# EAGLE design HG8M_breakout (EAGLE 7.1.0)
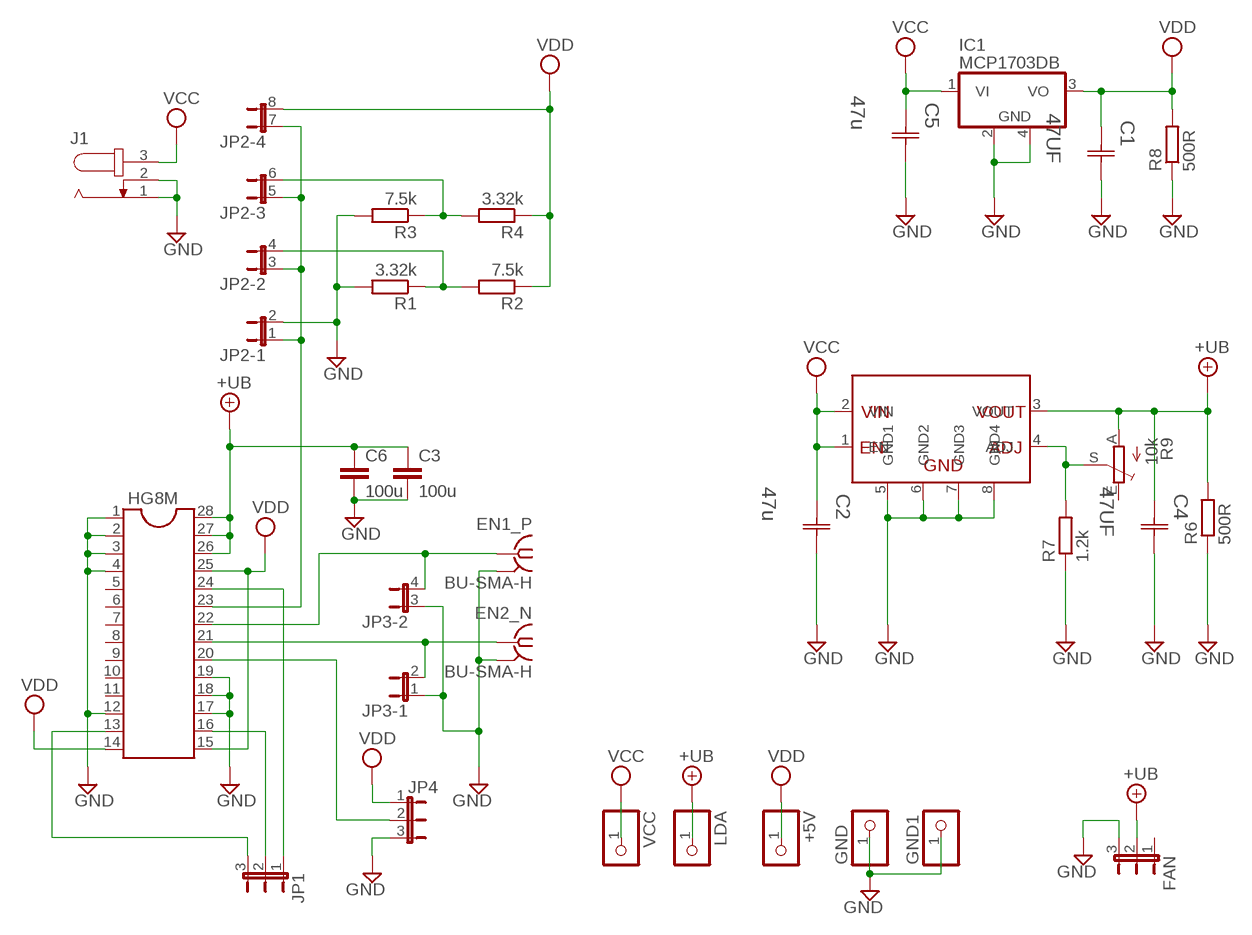
[diagram p0: schematic, sheet 1]

## Parts
+5V  PINHD-1X1  [1X01]
C1  47UF  TPSC476M010R0350  [CAPCP6032X280N]
C2  47u  12101A471JAT2A  [CAPC3225X94N]
C3  100u  C-EUC1210  [C1210]
C4  47UF  TPSC476M010R0350  [CAPCP6032X280N]
C5  47u  12101A471JAT2A  [CAPC3225X94N]
C6  100u  C-EUC1210  [C1210]
EN1_P  BU-SMA-H  [BU-SMA-H]
EN2_N  BU-SMA-H  [BU-SMA-H]
FAN  JP2E  [JP2]
GND  PINHD-1X1  [1X01]
GND1  PINHD-1X1  [1X01]
HG8M  DIL28  [DIL28-6]
IC1  MCP1703DB  [SOT223]
J1  JACK-PLUG1  [SPC4078]
JP1  JP2E  [JP2]
JP2  JP4QE  [JP4Q]
JP3  JP2QE  [JP2Q]
JP4  JP2E  [JP2]
LDA  PINHD-1X1  [1X01]
R1  3.32k  R-EU_R0805  [R0805]
R2  7.5k  R-EU_R0805  [R0805]
R3  7.5k  R-EU_R0805  [R0805]
R4  3.32k  R-EU_R0805  [R0805]
R6  500R  R-EU_R0805  [R0805]
R7  1.2k  R-EU_R0805  [R0805]
R8  500R  R-EU_R0805  [R0805]
R9  10k  TRIM_EU-B64W  [B64W]
U$4  MIC39102  [SOIC8]
VCC  PINHD-1X1  [1X01]

## Nets
+UB: C3.1 C4.1(C1) C6.1 FAN.2 HG8M.26 HG8M.27 HG8M.28 LDA.1 R6.2 R9.A U$4.3(VOUT)
GND: C1.2(C2) C2.2(C2) C3.2 C4.2(C2) C5.2(C2) C6.2 EN1_P.2 EN1_P.3 EN1_P.4 EN1_P.5 EN2_N.2 EN2_N.3 EN2_N.4 EN2_N.5 FAN.3 GND1.1 GND.1 HG8M.1 HG8M.2 HG8M.3 HG8M.4 HG8M.12 HG8M.17 HG8M.18 HG8M.19 IC1.2(GND) IC1.4(TAP) J1.1 J1.2 JP2.2 JP3.1 JP3.3 JP4.3 R1.2 R3.2 R6.1 R7.1 R8.1 U$4.5(GND1) U$4.6(GND2) U$4.7(GND3) U$4.8(GND4)
N$1: EN1_P.1 HG8M.22 JP3.4
N$2: EN2_N.1 HG8M.21 JP3.2
N$3: HG8M.24 JP1.1
N$4: HG8M.16 JP1.2
N$5: R7.2 R9.S U$4.4(ADJ)
N$7: HG8M.13 JP1.3
N$8: HG8M.23 JP2.1 JP2.3 JP2.5 JP2.7
N$9: JP2.4 R1.1 R2.2
N$10: JP2.6 R3.1 R4.2
N$11: HG8M.20 JP4.2
VCC: C2.1(C1) C5.1(C1) IC1.1(VI) J1.3 U$4.1(EN) U$4.2(VIN) VCC.1
VDD: +5V.1 C1.1(C1) HG8M.14 HG8M.15 HG8M.25 IC1.3(VO) JP2.8 JP4.1 R2.1 R4.1 R8.2
Unconnected: FAN.1 HG8M.5 HG8M.6 HG8M.7 HG8M.8 HG8M.9 HG8M.10 HG8M.11 R9.E

## Library data of the parts
+5V GND GND1 LDA VCC = pinhead:PINHD-1X1: PIN HEADER
C1 C4 = AVX_By_element14_Batch_1:TPSC476M010R0350: Tantalum Capacitor , 2312; CAPACITANCETOLERANCE: ±20%; MPN: TPSC476M010R0350; OC_FARNELL: -; OC_NEWARK: 75M2932; SUPPLIER: AVX; VOLTAGERATING: 10V
C2 C5 = AVX_By_element14_Batch_1:12101A471JAT2A: Capacitor 1210; MPN: 12101A471JAT2A; OC_FARNELL: -; OC_NEWARK: 56J0129; SUPPLIER: AVX; TOLERANCE: ±5%; VALUE: 470PF; VOLTAGERATING: 100V
C3 C6 = rcl:C-EU: CAPACITOR, European symbol
EN1_P EN2_N = con-coax:BU-SMA-H: FEMALE SMA CONNECTOR Radiall; OC_FARNELL: unknown; OC_NEWARK: unknown
FAN JP1 JP4 = jumper:JP2E: JUMPER
HG8M = ic-package:DIL28: Dual In Line
IC1 = linear:MCP1703: 250 mA, 16V, Low Quiescent Current LDO Regulator Source: http://ww1.microchip.com/downloads/en/DeviceDoc/22049b.pdf
J1 = con-jack:JACK-PLUG: DC POWER JACK Power Jack, DC, Right Angle, Through Hole, Rated 5A at 16VDC, PC Terminals Distributor: Farnell (www.Farnell.de) Drawing: 84N1161.pdf / 84N1162.pdf Manufacturer: SPC Technology (www.spctechnology.com) Type: SPC4077 / SPC 4078; OC_FARNELL: unknown; OC_NEWARK: unknown
JP2 = jumper:JP4QE: JUMPER
JP3 = jumper:JP2QE: JUMPER
R1-R4 R6-R8 = rcl:R-EU_: RESISTOR, European symbol
R9 = pot:TRIM_EU-: POTENTIOMETER
U$4 = linear-technology:MIC39102

## Board
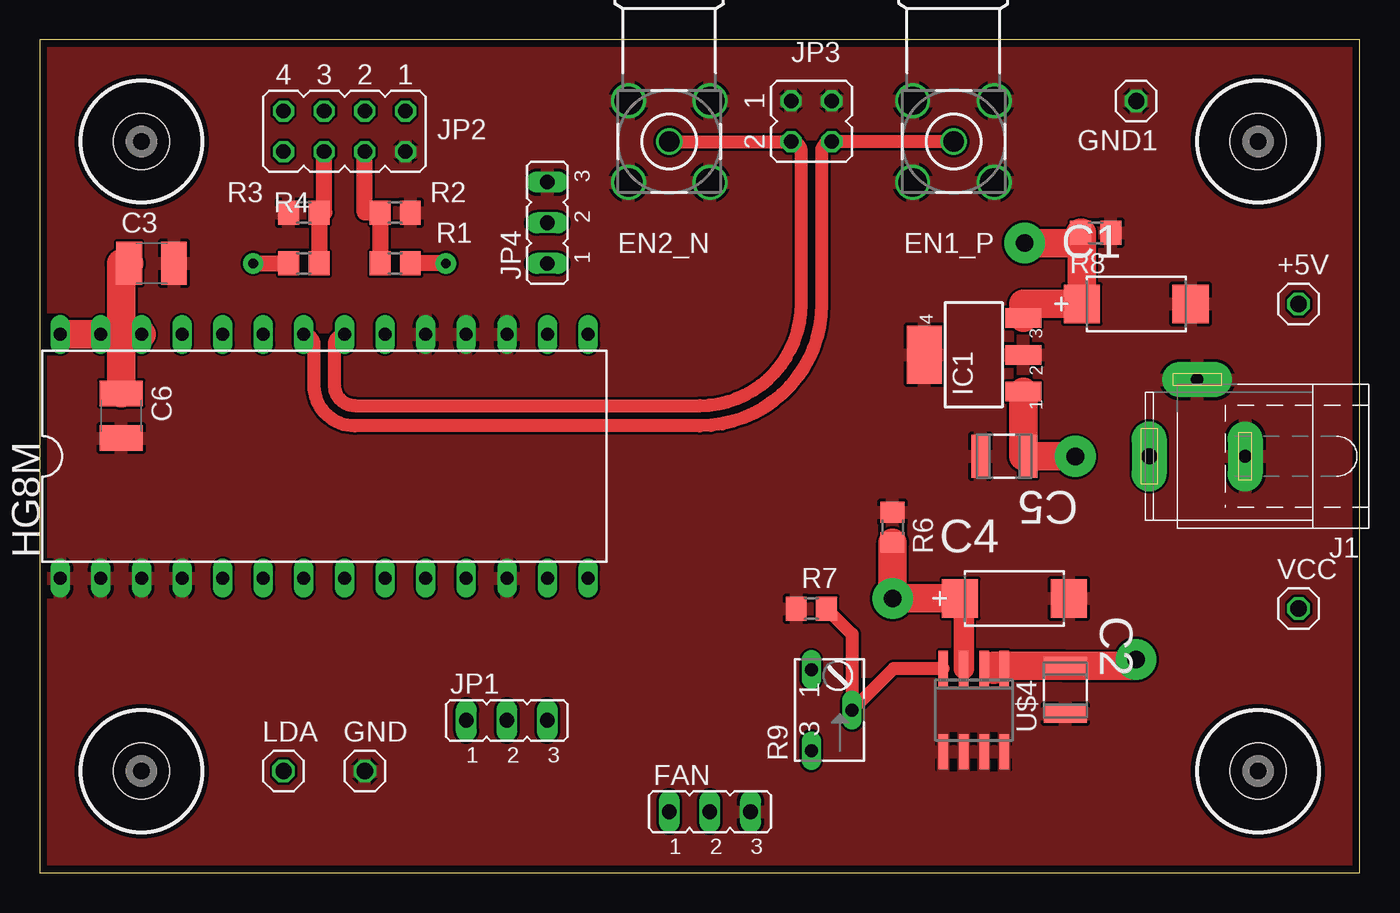
[diagram p1: board, top side]
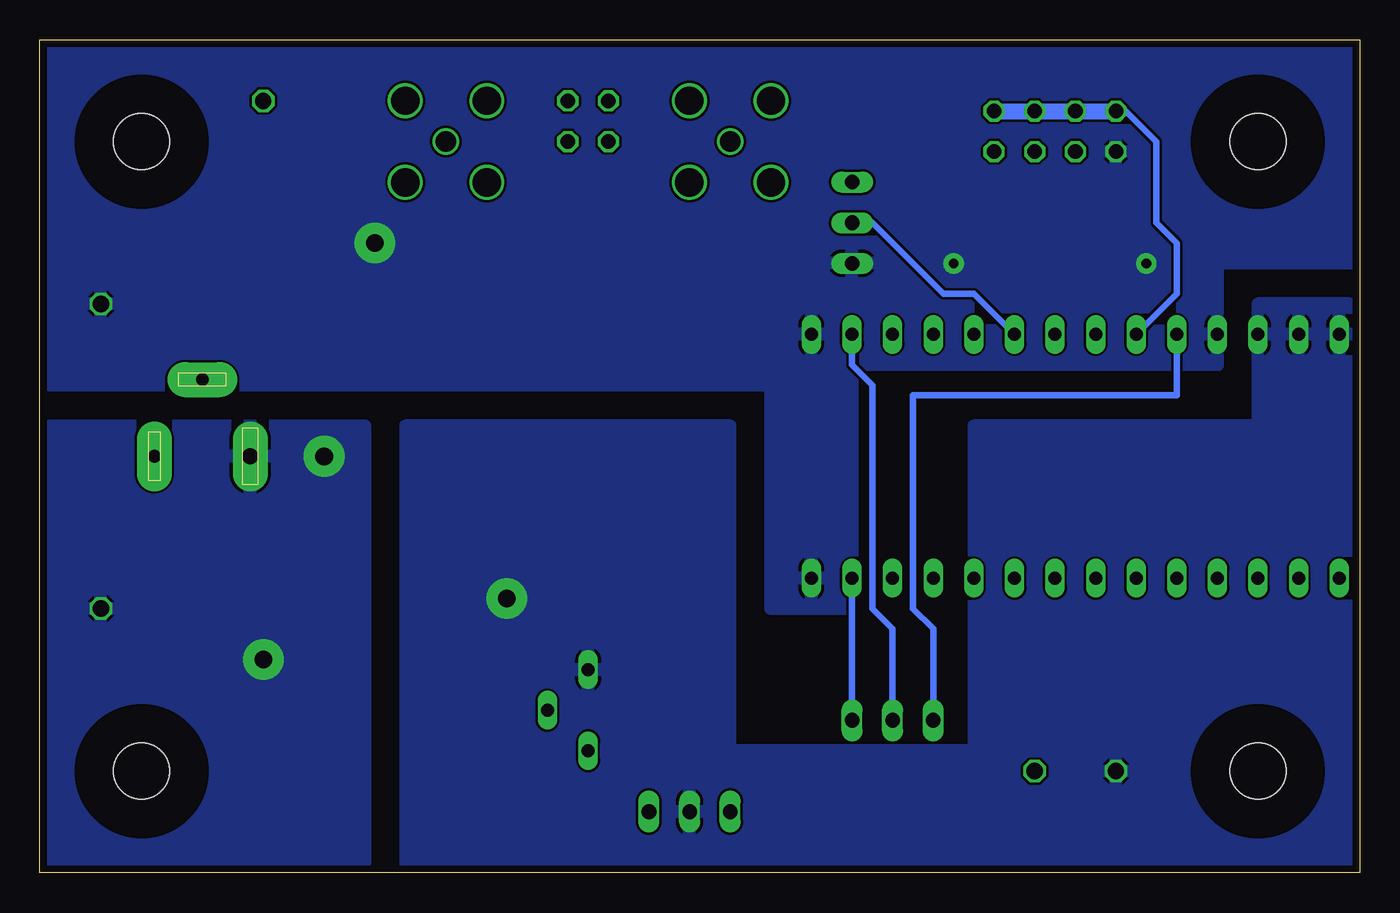
[diagram p2: board, bottom side, seen from below]

Size 82.55 x 52.07 mm. Coordinates in mm from the lower left corner, seen from the top.
Outline: 0,52.07 0,0 82.55,0 82.55,52.07 0,52.07
Copper layers (1*16): Top 0.018mm / dielectric 1.55mm / Bottom 0.018mm
Design rules "eC-PCB_proto-2-layer": minimum track width 0.15mm, minimum drill 0.25mm, track to track 0.15mm, track to pad 0.15mm, pad to pad 0.15mm, via to via 0.15mm, smd to smd 0.15mm, copper to edge 0.45mm, drill to drill 0.3mm, minimum pad ring 0.2mm, minimum via ring 0.2mm, stop-mask expansion 0.1mm, vias tented up to drill 0mil, thermal gap 0.2mm

### Footprints (pad centres in the part's own frame; a part is rotated, then mirrored left to right if it is on the bottom)
1X01 = drill 1.016 octagon: 1 0,0
CAPCP6032X280N = smd 2.261 x 2.413: 1 -3.404,0; 2 3.404,0
CAPC3225X94N = smd 1.118 x 2.692: 1 -1.499,0; 2 1.499,0
C1210 = smd 1.6 x 2.7: 1 -1.4,0; 2 1.4,0
BU-SMA-H = drill 1.27: 1 0,0 | drill 1.778: 2 -2.55,2.55; 3 2.55,2.55; 4 2.55,-2.55; 5 -2.55,-2.55
JP2 = drill 0.914 long: 1 -2.54,0; 2 0,0; 3 2.54,0
DIL28-6 = drill 0.813 long: 1 -16.51,-7.62; 2 -13.97,-7.62; 3 -11.43,-7.62; 4 -8.89,-7.62; 5 -6.35,-7.62; 6 -3.81,-7.62; 7 -1.27,-7.62; 8 1.27,-7.62; 9 3.81,-7.62; 10 6.35,-7.62; 11 8.89,-7.62; 12 11.43,-7.62; 13 13.97,-7.62; 14 16.51,-7.62; 15 16.51,7.62; 16 13.97,7.62; 17 11.43,7.62; 18 8.89,7.62; 19 6.35,7.62; 20 3.81,7.62; 21 1.27,7.62; 22 -1.27,7.62; 23 -3.81,7.62; 24 -6.35,7.62; 25 -8.89,7.62; 26 -11.43,7.62; 27 -13.97,7.62; 28 -16.51,7.62
SOT223 = smd 1.219 x 2.235: 1 -2.311,-3.099; 2 0,-3.099; 3 2.311,-3.099 | smd 3.6 x 2.2: 4 0,3.099
SPC4078 = drill 0.8 pad 2.184 long: 1 -3,0; 2 0,-4.8 | drill 1 pad 2.184 long: 3 3,0
JP4Q = drill 0.914 octagon: 1 -3.81,-1.27; 2 -3.81,1.27; 3 -1.27,-1.27; 4 -1.27,1.27; 5 1.27,-1.27; 6 1.27,1.27; 7 3.81,-1.27; 8 3.81,1.27
JP2Q = drill 0.914 octagon: 1 -1.27,-1.27; 2 1.27,-1.27; 3 -1.27,1.27; 4 1.27,1.27
R0805 = smd 1.3 x 1.5: 1 -0.95,0; 2 0.95,0
B64W = drill 0.813 long: A 2.54,0; E -2.54,0; S 0,-2.54
DRIL-3,5 = hole 3.5: 0,0
SOIC8 = smd 0.6 x 2.2: 1 -1.905,-2.6; 2 -0.635,-2.6; 3 0.635,-2.6; 4 1.905,-2.6; 5 1.905,2.6; 6 0.635,2.6; 7 -0.635,2.6; 8 -1.905,2.6

### Placement (x,y rotation side)
+5V  78.74,35.56 0 top
C1  68.58,35.56 0 top
C2  64.14,11.43 270 top
C3  6.99,38.1 0 top
C4  60.96,17.14 0 top
C5  60.33,26.04 180 top
C6  5.08,28.57 270 top
EN1_P  57.15,45.72 90 top
EN2_N  39.37,45.72 90 top
FAN  41.91,3.81 0 top
GND  20.32,6.35 0 top
GND1  68.58,48.26 180 top
HG8M  17.78,26.04 0 top
IC1  58.42,32.38 90 top
J1  72.39,26.04 180 top
JP1  29.21,9.53 0 top
JP2  19.05,46.35 180 top
JP3  48.26,46.99 270 top
JP4  31.75,40.64 90 top
LDA  15.24,6.35 0 top
R1  22.23,41.27 0 top
R2  22.23,38.1 180 top
R3  16.51,41.27 180 top
R4  16.51,38.1 0 top
R6  53.34,21.59 270 top
R7  48.26,16.51 0 top
R8  66.04,40.01 180 top
R9  48.26,10.16 90 top
U$1  [DRIL-3,5]  76.2,45.72 270 top
U$2  [DRIL-3,5]  76.2,6.35 270 top
U$3  [DRIL-3,5]  6.35,45.72 270 top
U$4  58.42,10.16 180 top
U$5  [DRIL-3,5]  6.35,6.35 270 top
VCC  78.74,16.51 0 top

### Tracks (layer width: path | path; a pad name or v marks a point on that pad's centre or on a via)
+UB  (via drill 1.1 pad 2.54)
  Top 1.27: U$4.3 57.78,16.92 C4.1
  Top 1.778: R6.2 v53.34,17.14 C4.1 | 5.08,33.66 HG8M.27 1.91,33.66 | C6.1 5.08,33.66 | 5.08,33.66 HG8M.26 | C3.1 5.08,38.1 5.08,33.66
  pour Bottom: 0.64,35.56 6.35,35.56 6.35,27.94 24.13,27.94 24.13,7.62 39.37,7.62 39.37,27.94 59.69,27.94 59.69,0.64 0.64,0.64
GND
  pour Top: 0.64,51.44 81.92,51.44 81.92,0.64 0.64,0.64
N$1
  Top 0.813: EN1_P.1 JP3.4 arc90 48.9,45.09 48.9,35.56 arc-90 41.27,27.94 19.68,27.94 arc-90 17.14,30.48 17.14,33.02 arc90 HG8M.22
N$2
  Top 0.813: EN2_N.1 JP3.2 arc-90 47.62,45.09 47.62,35.56 arc-90 41.27,29.21 19.68,29.21 arc-90 18.41,30.48 18.41,33.02 arc-90 HG8M.21
N$3
  Bottom 0.406: HG8M.24 11.43,29.84 27.94,29.84 27.94,16.51 26.67,15.24 JP1.1
N$4
  Bottom 0.406: HG8M.16 31.75,31.75 30.48,30.48 30.48,16.51 29.21,15.24 JP1.2
N$5
  Top 0.813: U$4.4 53.4,12.76 R9.S 50.8,14.92 R7.2
N$7
  Bottom 0.406: HG8M.13 JP1.3
N$8
  Bottom 0.406: JP2.7 14.61,47.62 12.7,45.72 12.7,40.64 11.43,39.37 11.43,36.2 HG8M.23
  Bottom 1.016: JP2.1 JP2.3 JP2.5 JP2.7
N$9
  Top 1.016: R2.2 R1.1 20.32,41.27 JP2.4
N$10
  Top 1.016: R4.2 R3.1 17.78,41.27 JP2.6
N$11
  Bottom 0.406: JP4.2 30.48,40.64 26.04,36.2 24.13,36.2 HG8M.20
VCC  (via drill 1.1 pad 2.54)
  Top 0.406: U$4.1 60.33,12.7 59.69,12.7 59.05,12.7 U$4.2
  Top 1.778: v64.77,26.04 C5.1 61.52,26.04 IC1.1 | v68.58,13.34 68.58,12.93 C2.1 59.69,12.93 59.69,12.7
  pour Bottom: 62.23,27.94 62.23,0.64 81.92,0.64 81.92,27.94
VDD  (via drill 0.6 pad 1.27, 1.1 pad 2.54)
  Top 1.016: v13.34,38.1 R4.1 | v25.4,38.1 R2.1
  Top 1.778: IC1.3 61.52,35.56 C1.1 65.18,40.01 R8.2 65.09,39.37 v61.59,39.37
  pour Bottom: 0.64,51.44 0.64,38.1 8.89,38.1 8.89,31.75 31.75,31.75 31.75,16.51 36.83,16.51 36.83,30.48 81.92,30.48 81.92,51.44